# EAGLE design debuger (EAGLE 6.2)
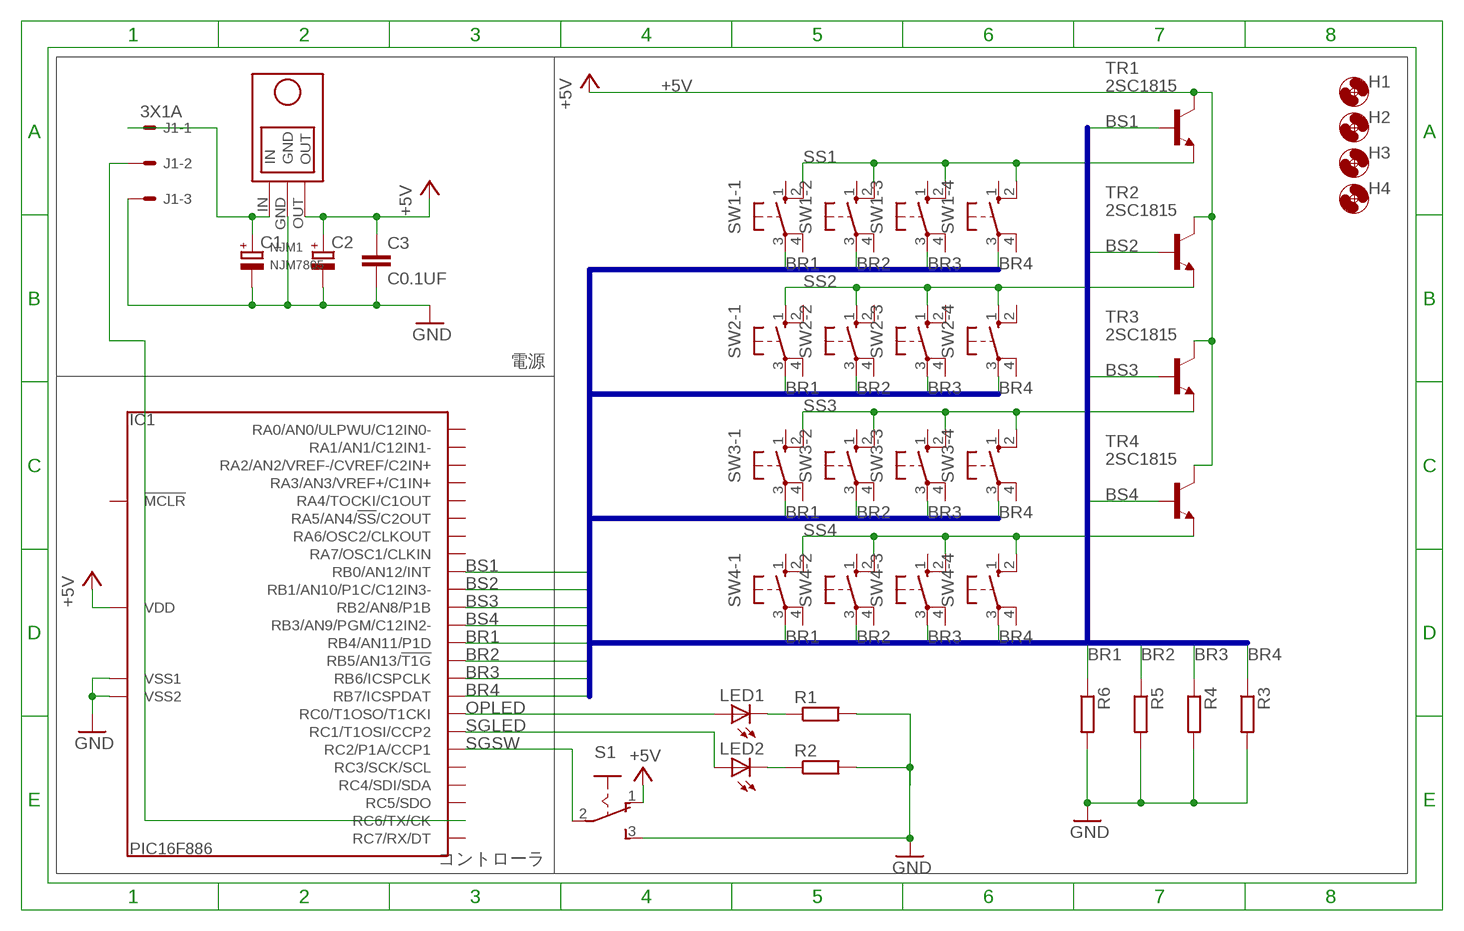
[diagram p0: schematic, sheet 1]

## Parts
C1  CPOL-EU2-5MM  [E2-5]
C2  CPOL-EU2-5MM  [E2-5]
C3  C0.1UF  [C0.1UF]
H1  HOLE3.3M3BOLT  [HOLE3.3]
H2  HOLE3.3M3BOLT  [HOLE3.3]
H3  HOLE3.3M3BOLT  [HOLE3.3]
H4  HOLE3.3M3BOLT  [HOLE3.3]
IC1  PIC16F886  [DIL28]
J1  3X1A  [37203-62A3-003]
LED1  LED5MM  [LED5MM]
LED2  LED5MM  [LED5MM]
NJM1  NJM7805  [NJM7805]
R1  R-EU_R3216W  [R3216W]
R2  R-EU_R3216W  [R3216W]
R3  R-EU_R3216W  [R3216W]
R4  R-EU_R3216W  [R3216W]
R5  R-EU_R3216W  [R3216W]
R6  R-EU_R3216W  [R3216W]
S1  SLIDESW  [SLIDESW]
SW1-1  TACTSW  [TACT]
SW1-2  TACTSW  [TACT]
SW1-3  TACTSW  [TACT]
SW1-4  TACTSW  [TACT]
SW2-1  TACTSW  [TACT]
SW2-2  TACTSW  [TACT]
SW2-3  TACTSW  [TACT]
SW2-4  TACTSW  [TACT]
SW3-1  TACTSW  [TACT]
SW3-2  TACTSW  [TACT]
SW3-3  TACTSW  [TACT]
SW3-4  TACTSW  [TACT]
SW4-1  TACTSW  [TACT]
SW4-2  TACTSW  [TACT]
SW4-3  TACTSW  [TACT]
SW4-4  TACTSW  [TACT]
TR1  2SC1815  [TO92-]
TR2  2SC1815  [TO92-]
TR3  2SC1815  [TO92-]
TR4  2SC1815  [TO92-]

## Nets
+5V: C2.+ C3.1 IC1.20(VDD) NJM1.OUT S1.1 TR1.C TR2.C TR3.C TR4.C
BR1: IC1.25(RB4/AN11/P1D) R6.1 SW1-1.3(P) SW2-1.3(P) SW3-1.3(P) SW4-1.3(P)
BR2: IC1.26(RB5/AN13/!T1G) R5.1 SW1-2.3(P) SW2-2.3(P) SW3-2.3(P) SW4-2.3(P)
BR3: IC1.27(RB6/ICSPCLK) R4.1 SW1-3.3(P) SW2-3.3(P) SW3-3.3(P) SW4-3.3(P)
BR4: IC1.28(RB7/ICSPDAT) R3.1 SW1-4.3(P) SW2-4.3(P) SW3-4.3(P) SW4-4.3(P)
BS1: IC1.21(RB0/AN12/INT) TR1.B
BS2: IC1.22(RB1/AN10/P1C/C12IN3-) TR2.B
BS3: IC1.23(RB2/AN8/P1B) TR3.B
BS4: IC1.24(RB3/AN9/PGM/C12IN2-) TR4.B
GND: C1.- C2.- C3.2 IC1.8(VSS1) IC1.19(VSS2) J1.1-3 NJM1.GND R1.2 R2.2 R3.2 R4.2 R5.2 R6.2 S1.3
N$1: C1.+ J1.1-1 NJM1.IN
N$2: IC1.17(RC6/TX/CK) J1.1-2
N$3: LED1.K(C) R1.1
N$4: LED2.K(C) R2.1
OPLED: IC1.11(RC0/T1OSO/T1CKI) LED1.A
SGLED: IC1.12(RC1/T1OSI/CCP2) LED2.A
SGSW: IC1.13(RC2/P1A/CCP1) S1.2
SS1: SW1-1.2(S1) SW1-2.2(S1) SW1-3.2(S1) SW1-4.2(S1) TR1.E
SS2: SW2-1.1(S) SW2-2.1(S) SW2-3.1(S) SW2-4.1(S) TR2.E
SS3: SW3-1.2(S1) SW3-2.2(S1) SW3-3.2(S1) SW3-4.2(S1) TR3.E
SS4: SW4-1.2(S1) SW4-2.2(S1) SW4-3.2(S1) SW4-4.2(S1) TR4.E
Unconnected: IC1.1(!MCLR) IC1.2(RA0/AN0/ULPWU/C12IN0-) IC1.3(RA1/AN1/C12IN1-) IC1.4(RA2/AN2/VREF-/CVREF/C2IN+) IC1.5(RA3/AN3/VREF+/C1IN+) IC1.6(RA4/TOCKI/C1OUT) IC1.7(RA5/AN4/!SS!/C2OUT) IC1.9(RA7/OSC1/CLKIN) IC1.10(RA6/OSC2/CLKOUT) IC1.14(RC3/SCK/SCL) IC1.15(RC4/SDI/SDA) IC1.16(RC5/SDO) IC1.18(RC7/RX/DT) SW1-1.1(S) SW1-1.4(P1) SW1-2.1(S) SW1-2.4(P1) SW1-3.1(S) SW1-3.4(P1) SW1-4.1(S) SW1-4.4(P1) SW2-1.2(S1) SW2-1.4(P1) SW2-2.2(S1) SW2-2.4(P1) SW2-3.2(S1) SW2-3.4(P1) SW2-4.2(S1) SW2-4.4(P1) SW3-1.1(S) SW3-1.4(P1) SW3-2.1(S) SW3-2.4(P1) SW3-3.1(S) SW3-3.4(P1) SW3-4.1(S) SW3-4.4(P1) SW4-1.1(S) SW4-1.4(P1) SW4-2.1(S) SW4-2.4(P1) SW4-3.1(S) SW4-3.4(P1) SW4-4.1(S) SW4-4.4(P1)

## Buses
B$1

## Notes on the sheet
- 電源
- コントローラ

## Library data of the parts
C1 C2 = FP-21T for MITS:CPOL-EU2
C3 = FP-21T for MITS:C0.1UF
H1-H4 = Hole:HOLE3.3
IC1 = PIC:PIC16F886
J1 = 3M_372xx:3X1
LED1 LED2 = FP-21T for MITS:LED: LED OSRAM: - CHIPLED LG R971, LG N971, LY N971, LG Q971, LY Q971, LO R971, LY R971 LH N974, LH R974 LS Q976, LO Q976, LY Q976 LO Q996 - Hyper CHIPLED LW Q18S LB Q993, LB Q99A, LB R99A - SideLED LS A670, LO A670, LY A670, LG A670, LP A670 LB A673, LV A673, LT A673, LW A673 LH A674 LY A675 LS A676, LA A676, LO A676, LY A676, LW A676 LS A679, LY A679, LG A679 - Hyper Micro SIDELED® LS Y876, LA Y876, LO Y876, LY Y876 LT Y87S - SmartLED LW L88C, LW L88S LB L89C, LB L89S, LG L890 LS L89K, LO L89K, LY L89K LS L896, LA L896, LO L896, LY L896 - TOPLED LS T670, LO T670, LY T670, LG T670, LP T670 LSG T670, LSP T670, LSY T670, LOP T670, LYG T670 LG T671, LOG T671, LSG T671 LB T673, LV T673, LT T673, LW T673 LH T674 LS T676, LA T676, LO T676, LY T676, LB T676, LH T676, LSB T676, LW T676 LB T67C, LV T67C, LT T67C, LS T67K, LO T67K, LY T67K, LW E67C LS E67B, LA E67B, LO E67B, LY E67B, LB E67C, LV E67C, LT E67C LW T67C LS T679, LY T679, LG T679 LS T770, LO T770, LY T770, LG T770, LP T770 LB T773, LV T773, LT T773, LW T773 LH T774 LS E675, LA E675, LY E675, LS T675 LS T776, LA T776, LO T776, LY T776, LB T776 LHGB T686 LT T68C, LB T68C - Hyper Mini TOPLED® LB M676 - Mini TOPLED Santana® LG M470 LS M47K, LO M47K, LY M47K Source: http://www.osram.convergy.de - LUMILED® LXK2-PW12-R00, LXK2-PW12-S00, LXK2-PW14-U00, LXK2-PW14-V00 LXK2-PM12-R00, LXK2-PM12-S00, LXK2-PM14-U00 LXK2-PE12-Q00, LXK2-PE12-R00, LXK2-PE12-S00, LXK2-PE14-T00, LXK2-PE14-U00 LXK2-PB12-K00, LXK2-PB12-L00, LXK2-PB12-M00, LXK2-PB14-N00, LXK2-PB14-P00, LXK2-PB14-Q00 LXK2-PR12-L00, LXK2-PR12-M00, LXK2-PR14-Q00, LXK2-PR14-R00 LXK2-PD12-Q00, LXK2-PD12-R00, LXK2-PD12-S00 LXK2-PH12-R00, LXK2-PH12-S00 LXK2-PL12-P00, LXK2-PL12-Q00, LXK2-PL12-R00 Source: www.luxeon.com
NJM1 = My_NJM7805:NJM7805
R1-R6 = rcl:R-EU_: RESISTOR, European symbol
S1 = switch:SLIDESW
SW1-1-SW1-4 SW2-1-SW2-4 SW3-1-SW3-4 SW4-1-SW4-4 = pushsw:TACTSW
TR1-TR4 = FP-21T for MITS:2SC1815

## Board
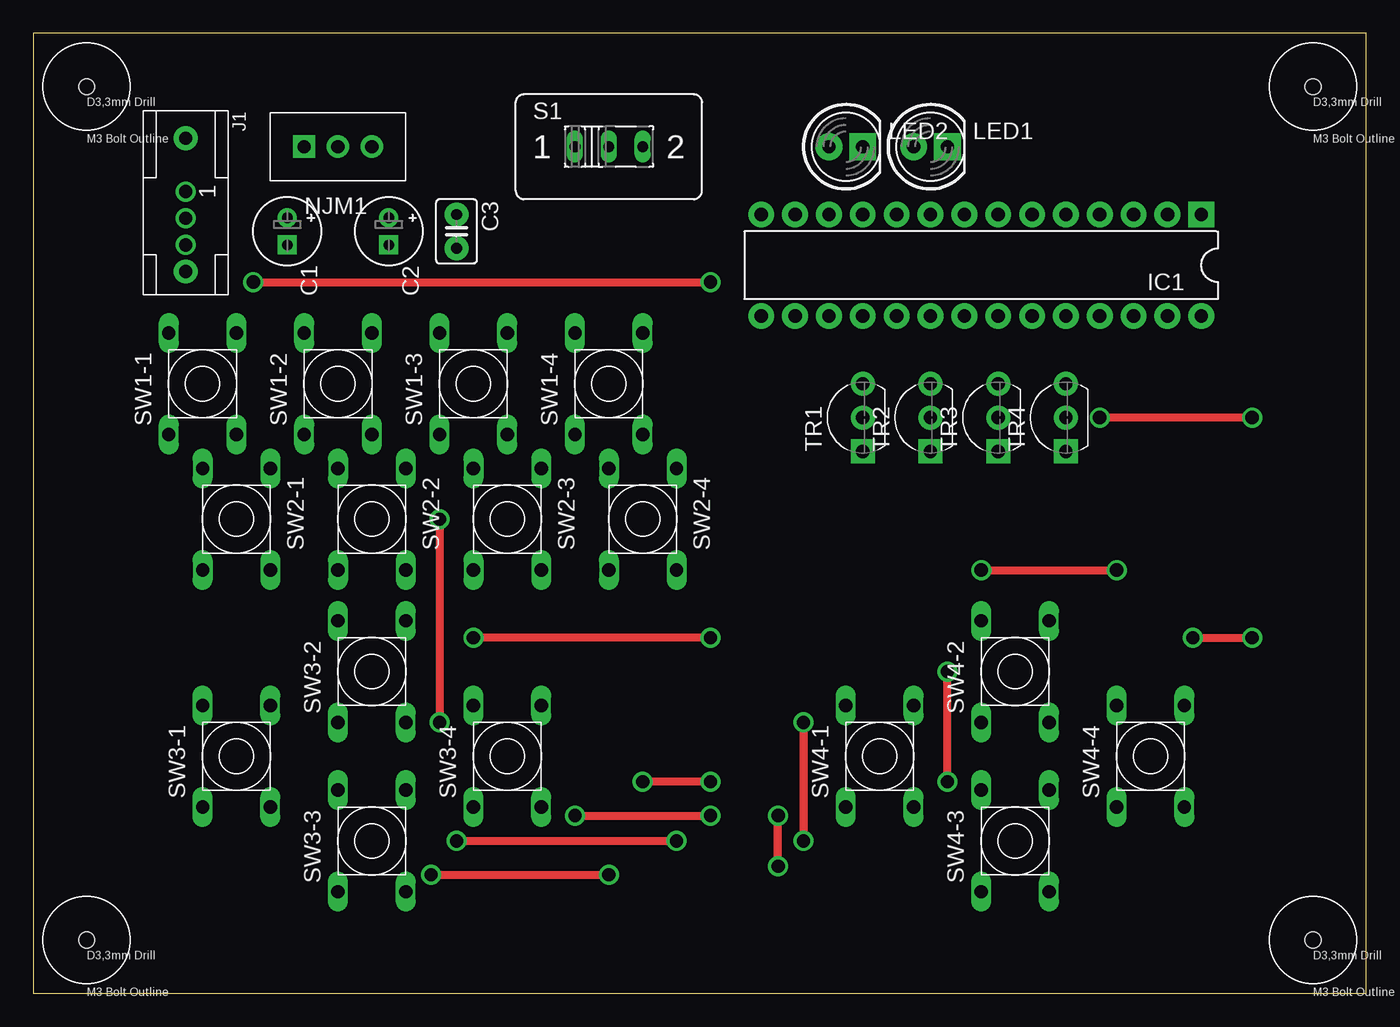
[diagram p1: board, top side]
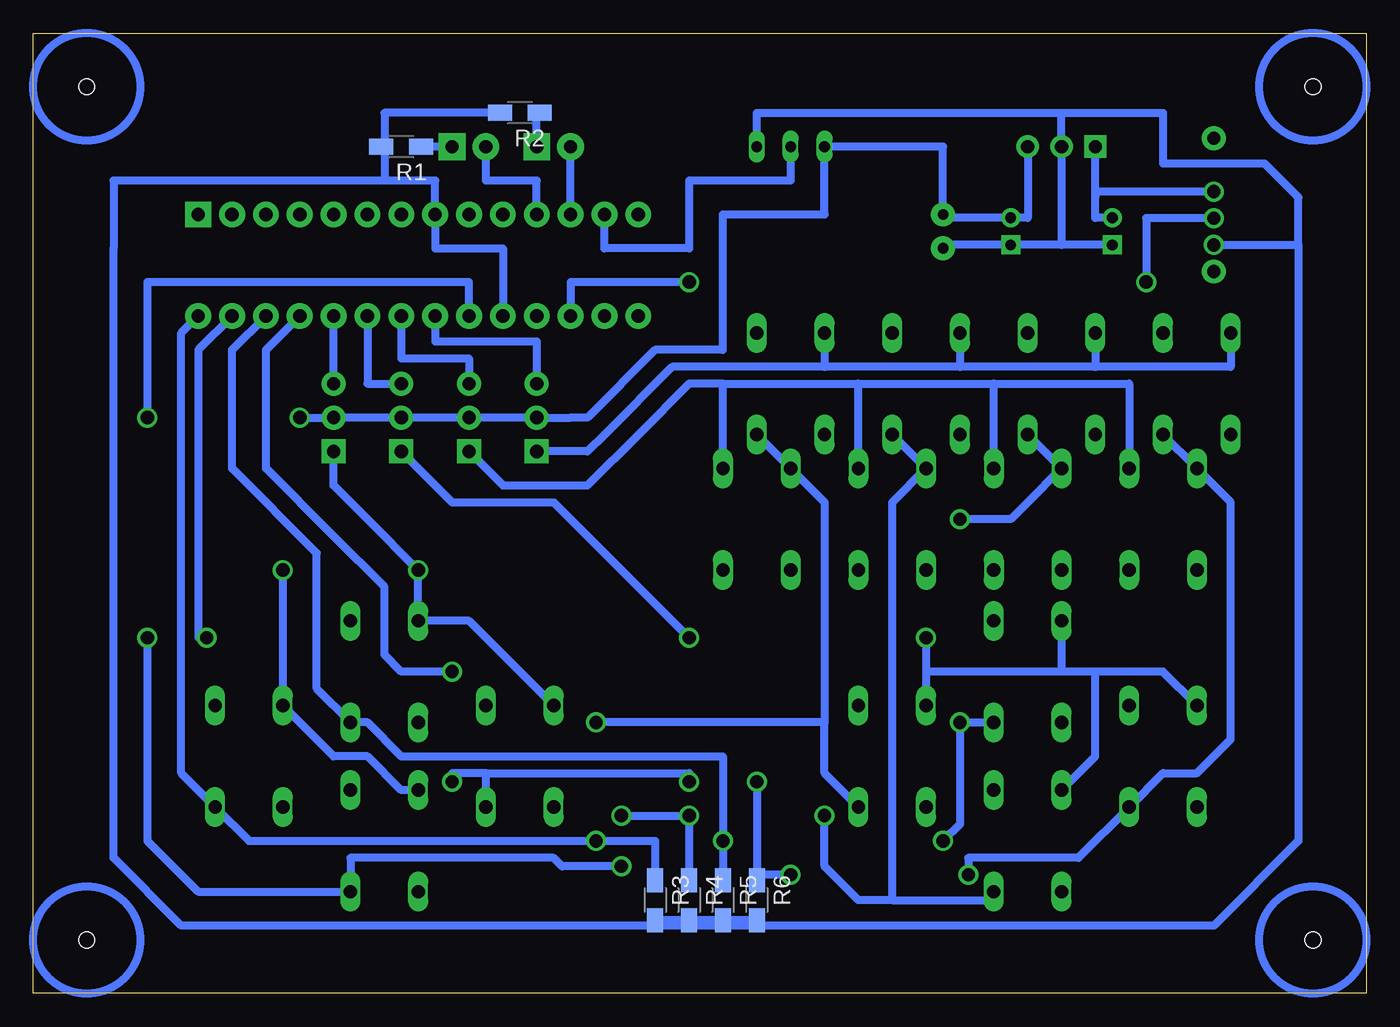
[diagram p2: board, bottom side, seen from below]

Size 100 x 72 mm. Coordinates in mm from the lower left corner, seen from the top.
Outline: 0,0 100,0 100,72 0,72 0,0
Copper layers (1*16): Top 0.035mm / dielectric 1.5mm / Bottom 0.035mm
Design rules: minimum track width 0.15mm, minimum drill 0.3mm, track to track 0.25mm, track to pad 0.25mm, pad to pad 0.25mm, via to via 0.25mm, smd to smd 0.2mm, copper to edge 0.7mm, drill to drill 0.45mm, minimum pad ring 0.15mm, minimum via ring 0.15mm, stop-mask expansion 4mil, vias tented up to drill 0mil, thermal gap 0.15mm

### Footprints (pad centres in the part's own frame; a part is rotated, then mirrored left to right if it is on the bottom)
E2-5 = drill 0.8 pad 1.422: + -1.016,0 | drill 0.8 pad 1.422 square: - 1.016,0
C0.1UF = drill 0.8 pad 1.778: 1 -1.27,0; 2 1.27,0
HOLE3.3 = hole 1.2: 0,0
DIL28 = drill 1 pad 1.93 square: 1 -16.51,-3.81 | drill 1 pad 1.93: 2 -13.97,-3.81; 3 -11.43,-3.81; 4 -8.89,-3.81; 5 -6.35,-3.81; 6 -3.81,-3.81; 7 -1.27,-3.81; 8 1.27,-3.81; 9 3.81,-3.81; 10 6.35,-3.81; 11 8.89,-3.81; 12 11.43,-3.81; 13 13.97,-3.81; 14 16.51,-3.81; 15 16.51,3.81; 16 13.97,3.81; 17 11.43,3.81; 18 8.89,3.81; 19 6.35,3.81; 20 3.81,3.81; 21 1.27,3.81; 22 -1.27,3.81; 23 -3.81,3.81; 24 -6.35,3.81; 25 -8.89,3.81; 26 -11.43,3.81; 27 -13.97,3.81; 28 -16.51,3.81
37203-62A3-003 = drill 1: 1-1 0,4; 1-2 0,6; 1-3 0,8 | drill 1 pad 1.778: P$1 0,0; P$2 0,10
LED5MM = drill 1 pad 2: A -1.27,0 | drill 1 pad 2 square: K 1.27,0
NJM7805 = drill 1 pad 1.676: GND 0,0; OUT 2.54,0 | drill 1 pad 1.676 square: IN -2.54,0
R3216W = smd 1.8 x 1.2: 1 -1.499,0; 2 1.499,0
SLIDESW = drill 0.8 long: 1 -2.54,0; 2 0,0; 3 2.54,0
TACT = drill 1 long: 1 -3.81,2.54; 2 3.81,2.54; 3 -3.81,-2.54; 4 3.81,-2.54
TO92- = drill 1 pad 1.8: B 2.54,0; C 0,0 | drill 1 pad 1.8 square: E -2.54,0

### Placement (x,y rotation side)
C1  19.05,57.15 270 top
C2  26.67,57.15 270 top
C3  31.75,57.15 270 top
H1  4,4 0 top
H2  96,68 0 top
H3  4,68 0 top
H4  96,4 0 top
IC1  71.12,54.61 180 top
J1  11.43,64.14 180 top
LED1  67.31,63.5 0 top
LED2  60.96,63.5 0 top
NJM1  22.86,63.5 0 top
R1  72.39,63.5 180 bottom
R2  63.5,66.04 180 bottom
R3  53.34,6.99 270 bottom
R4  50.8,6.99 270 bottom
R5  48.26,6.99 270 bottom
R6  45.72,6.99 270 bottom
S1  43.18,63.5 0 top
SW1-1  12.7,45.72 90 top
SW1-2  22.86,45.72 90 top
SW1-3  33.02,45.72 90 top
SW1-4  43.18,45.72 90 top
SW2-1  15.24,35.56 270 top
SW2-2  25.4,35.56 270 top
SW2-3  35.56,35.56 270 top
SW2-4  45.72,35.56 270 top
SW3-1  15.24,17.78 90 top
SW3-2  25.4,24.13 90 top
SW3-3  25.4,11.43 90 top
SW3-4  35.56,17.78 90 top
SW4-1  63.5,17.78 90 top
SW4-2  73.66,24.13 90 top
SW4-3  73.66,11.43 90 top
SW4-4  83.82,17.78 90 top
TR1  62.23,43.18 90 top
TR2  67.31,43.18 90 top
TR3  72.39,43.18 90 top
TR4  77.47,43.18 90 top

### Tracks (layer width: path | path; a pad name or v marks a point on that pad's centre or on a via)
+5V  (via drill 1)
  Top 0.61: v91.44,43.18 v80.01,43.18
  Bottom 0.61: NJM1.OUT 25.4,58.17 C2.+ 31.75,58.17 C3.1 31.75,63.5 S1.1 40.64,58.42 48.26,58.42 48.26,48.26 53.34,48.26 58.42,43.18 59.69,43.18 TR1.C TR2.C TR3.C TR4.C v80.01,43.18 | IC1.20 67.31,53.34 91.44,53.34 v91.44,43.18
BR1  (via drill 1)
  Top 0.61: v29.84,8.89 v43.18,8.89 | v50.8,15.88 v45.72,15.88 | v68.58,15.88 v68.58,24.13
  Bottom 0.61: SW1-1.3 SW2-1.3 10.16,36.83 10.16,19.05 12.7,16.51 15.24,16.51 SW3-1.3 21.59,10.16 29.84,10.16 v29.84,8.89 | 45.72,8.89 R6.1 | SW4-1.3 66.04,16.51 | 45.72,8.89 R6.1 | v43.18,8.89 45.72,8.89 | 45.72,8.89 R6.1 | 66.04,16.51 50.8,16.51 v50.8,15.88 | v45.72,15.88 R6.1 | 66.04,16.51 68.58,16.51 v68.58,15.88 | IC1.25 82.55,48.26 82.55,39.37 77.47,34.29 73.66,30.48 73.66,25.4 72.39,24.13 v68.58,24.13
BR2  (via drill 1)
  Top 0.61: v30.48,35.56 v30.48,20.32 | v31.75,11.43 v48.26,11.43
  Bottom 0.61: SW3-2.3 v30.48,20.32 30.48,12.7 v31.75,11.43 | SW1-2.3 SW2-2.3 25.4,36.83 26.67,35.56 v30.48,35.56 | R5.1 v48.26,11.43 48.26,17.78 72.39,17.78 74.93,20.32 SW4-2.3 78.74,22.86 78.74,33.02 85.09,39.37 85.09,48.26 IC1.26
BR3  (via drill 1)
  Top 0.61: v55.88,9.53 v55.88,13.34 | v40.64,13.34 v50.8,13.34 | v87,26.67 v91.44,26.67
  Bottom 0.61: 35.56,6.99 27.94,6.99 SW3-3.3 | SW1-3.3 SW2-3.3 35.56,36.83 35.56,6.99 | R4.1 v50.8,13.34 v55.88,13.34 | v55.88,9.53 60.33,9.53 60.96,10.16 76.2,10.16 SW4-3.3 87.63,7.62 91.44,11.43 v91.44,26.67 | IC1.27 87.63,48.26 87.63,26.67 v87,26.67 | 35.56,6.99 38.1,6.99 40.64,9.53 v40.64,13.34
BR4  (via drill 1)
  Top 0.61: v57.78,20.32 v57.78,11.43
  Bottom 0.61: SW1-4.3 SW2-4.3 40.64,36.83 40.64,20.32 | R3.1 53.34,11.43 57.15,11.43 | 40.64,20.32 v57.78,20.32 | v57.78,11.43 57.15,11.43 | IC1.28 88.9,49.53 88.9,16.51 SW4-4.3 83.82,11.43 57.15,11.43 | SW3-4.3 40.64,16.51 40.64,20.32
BS1
  Bottom 0.61: IC1.21 69.85,48.9 62.23,48.9 TR1.B
BS2
  Bottom 0.61: IC1.22 72.39,47.62 67.31,47.62 TR2.B
BS3
  Bottom 0.61: IC1.23 74.93,45.72 TR3.B
BS4
  Bottom 0.61: TR4.B IC1.24
GND
  Bottom 0.61: J1.1-3 5.08,56.13 | 5.08,56.13 5.08,11.43 11.43,5.08 53.34,5.08 | 53.34,5.08 88.9,5.08 93.98,10.16 93.98,38.1 93.98,55.88 93.98,60.96 73.66,60.96 | 22.86,66.04 NJM1.GND 22.86,56.13 | 22.86,66.04 15.24,66.04 15.24,62.23 7.62,62.23 5.08,59.69 5.08,56.13 | S1.3 45.72,66.04 22.86,66.04 | 73.66,60.96 69.85,60.96 IC1.8 69.85,55.88 64.77,55.88 IC1.19 | R1.2 73.66,63.5 73.66,60.96 | R2.2 73.66,66.04 73.66,60.96 | C1.- 22.86,56.13 | 22.86,56.13 C2.- 31.75,56.13 C3.2 | R6.2 R5.2 R4.2 R3.2 53.34,5.08
N$1
  Bottom 0.61: C1.+ 20.32,58.17 20.32,59.69 | 20.32,59.69 NJM1.IN | J1.1-1 20.32,60.13 20.32,59.69
N$2  (via drill 1)
  Top 0.61: v16.51,53.34 v50.8,53.34
  Bottom 0.61: J1.1-2 16.51,58.13 v16.51,53.34 | v50.8,53.34 59.69,53.34 IC1.17
N$3
  Bottom 0.61: LED1.K R1.1
N$4
  Bottom 0.61: LED2.K 62.23,66.04 R2.1
OPLED
  Bottom 0.61: IC1.11 62.23,60.96 66.04,60.96 LED1.A
SGLED
  Bottom 0.61: IC1.12 LED2.A
SGSW
  Bottom 0.61: S1.2 43.18,60.96 50.8,60.96 50.8,55.88 57.15,55.88 IC1.13
SS1
  Bottom 0.61: SW1-1.2 10.16,46.99 20.32,46.99 | 20.32,46.99 30.48,46.99 | 30.48,46.99 40.64,46.99 | SW1-2.2 20.32,46.99 | SW1-3.2 30.48,46.99 | SW1-4.2 40.64,46.99 | 40.64,46.99 52.07,46.99 57.15,41.91 58.42,40.64 TR1.E
SS2
  Bottom 0.61: 48.26,45.72 38.1,45.72 | 38.1,45.72 27.94,45.72 | 27.94,45.72 17.78,45.72 SW2-1.1 | SW2-2.1 27.94,45.72 | SW2-3.1 38.1,45.72 | SW2-4.1 48.26,45.72 | 48.26,45.72 50.8,45.72 54.61,41.91 58.42,38.1 64.77,38.1 TR2.E
SS3  (via drill 1)
  Top 0.61: v50.8,26.67 v33.02,26.67
  Bottom 0.61: v33.02,26.67 33.02,24.13 | 33.02,24.13 SW3-4.2 | 20.32,24.13 22.86,24.13 | 22.86,24.13 33.02,24.13 | SW3-2.2 22.86,24.13 | v50.8,26.67 60.96,36.83 68.58,36.83 TR3.E | SW3-3.2 20.32,17.78 20.32,24.13 | SW3-1.2 15.24,24.13 20.32,24.13
SS4  (via drill 1)
  Top 0.61: v71.12,31.75 v81.28,31.75
  Bottom 0.61: SW4-3.2 72.39,15.24 74.93,17.78 77.47,17.78 SW4-4.2 v81.28,31.75 | TR4.E 77.47,38.1 74.93,35.56 v71.12,31.75 SW4-2.2 67.31,27.94 SW4-1.2